# EAGLE design ir-reciever-test (EAGLE 6.3)
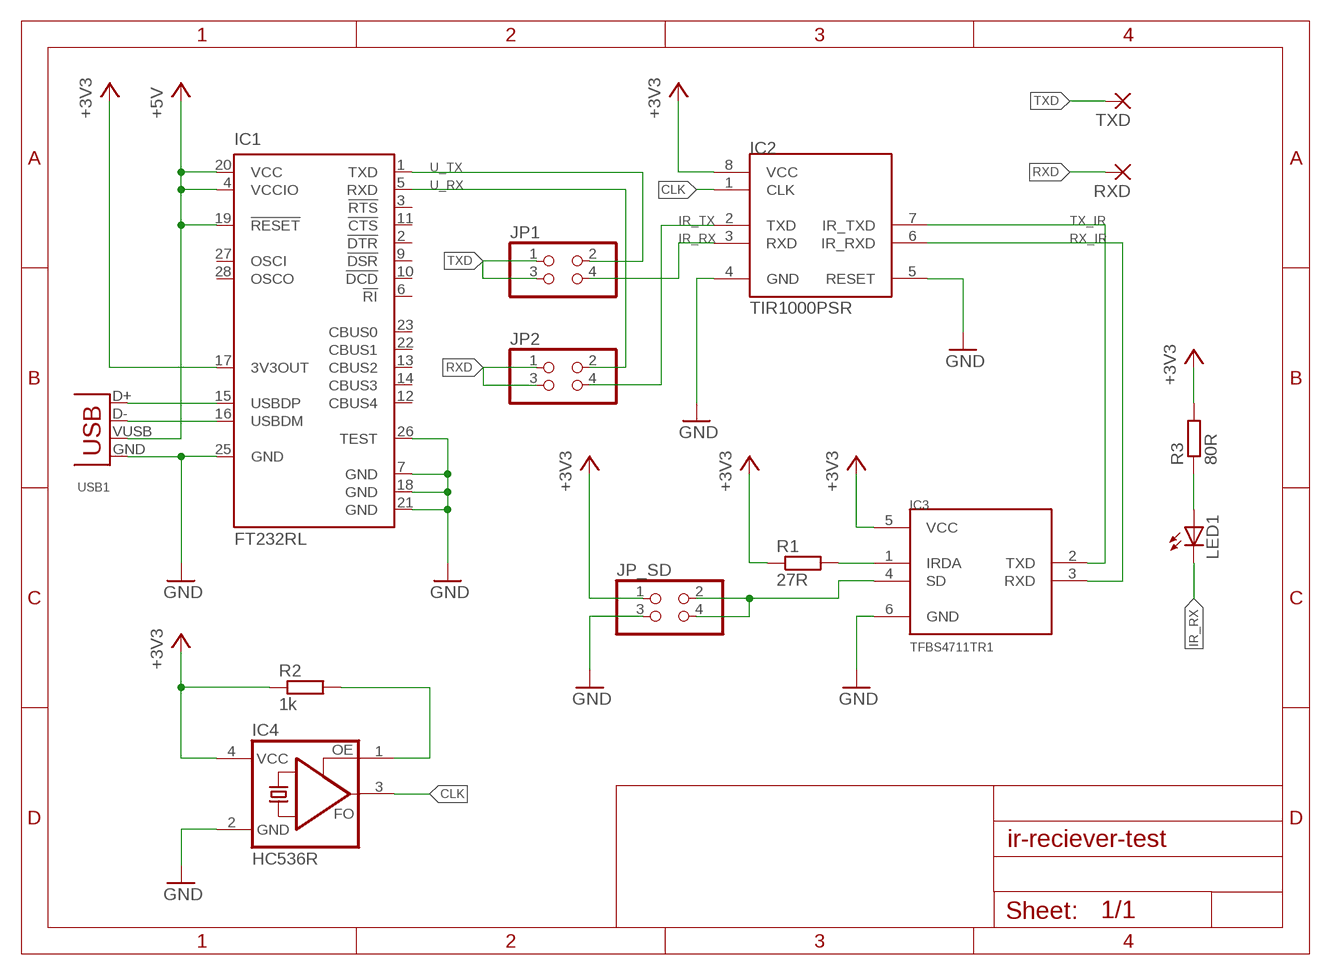
[diagram p0: schematic, sheet 1]

## Parts
IC1  FT232RL  [SSOP28]
IC2  TIR1000PSR  [SO-08]
IC3  TFBS4711TR1  [TFBS4711]
IC4  HC536R  [HC536]
JP1  PINHD-2X02_2.54-SMD  [2X02SMD]
JP2  PINHD-2X02_2.54-SMD  [2X02SMD]
JP_SD  PINHD-2X02_2.54-SMD  [2X02SMD]
LED1  LED3MM  [LED3MM]
R1  27R  R-EU_R1206  [R1206]
R2  1k  R-EU_R1206  [R1206]
R3  80R  R-EU_R1206  [R1206]
RXD  SMD5  [SMD2,54-5,08]
TXD  SMD5  [SMD2,54-5,08]
USB1  USB-B-S  [USB-B-SMT]

## Nets
+3V3: IC1.17(3V3OUT) IC2.8(VCC) IC3.5(VCC) IC4.4(VCC) JP_SD.1 R1.1 R2.1 R3.2
+5V: IC1.4(VCCIO) IC1.19(!RESET) IC1.20(VCC) USB1.VUSB(VBUS)
CLK: IC2.1(CLK) IC4.3(FO)
D+: IC1.15(USBDP) USB1.D+
D-: IC1.16(USBDM) USB1.D-
GND: IC1.7(GND) IC1.18(GND) IC1.21(GND) IC1.25(GND) IC1.26(TEST) IC2.4(GND) IC2.5(RESET) IC3.6(GND) IC4.2(GND) JP_SD.3 USB1.GND
IR_RX: IC2.3(RXD) JP1.4 LED1.K(C)
IR_TX: IC2.2(TXD) JP2.4
N$1: LED1.A R3.1
N$3: IC3.1(IRDA) R1.2
N$5: IC3.4(SD) JP_SD.2 JP_SD.4
N$6: IC4.1(OE) R2.2
RX_IR: IC2.6(IR_RXD) IC3.3(RXD)
RXD: JP2.1 JP2.3 RXD.1(P)
TX_IR: IC2.7(IR_TXD) IC3.2(TXD)
TXD: JP1.1 JP1.3 TXD.1(P)
U_RX: IC1.5(RXD) JP2.2
U_TX: IC1.1(TXD) JP1.2
Unconnected: IC1.2(!DTR) IC1.3(!RTS) IC1.6(!RI) IC1.9(!DSR) IC1.10(!DCD) IC1.11(!CTS) IC1.12(CBUS4) IC1.13(CBUS2) IC1.14(CBUS3) IC1.22(CBUS1) IC1.23(CBUS0) IC1.27(OSCI) IC1.28(OSCO)

## Library data of the parts
IC1 = ftdichip:FT232R: Source: http://www.ftdichip.com/Documents/DataSheets/DS_FT232R_v104.pdf
IC2 = texas:TIR1000: Texas Instruments TIR1000 STANDALONE IrDATM ENCODER AND DECODER
IC3 = vishay:TFBS4711: TRANSCEIVER IRDA Vishay TFBS4711-TR1 Infrared Transciever 900nm, 600µA, 1m range
IC4 = crystal:HC536: Crystal HC536R For example: Fox Electronics FOX-HC536R
JP1 JP2 JP_SD = pinhead-2:PINHD-2X02: PIN HEADER
LED1 = led:LED: LED OSRAM: - CHIPLED LG R971, LG N971, LY N971, LG Q971, LY Q971, LO R971, LY R971 LH N974, LH R974 LS Q976, LO Q976, LY Q976 LO Q996 - Hyper CHIPLED LW Q18S LB Q993, LB Q99A, LB R99A - SideLED LS A670, LO A670, LY A670, LG A670, LP A670 LB A673, LV A673, LT A673, LW A673 LH A674 LY A675 LS A676, LA A676, LO A676, LY A676, LW A676 LS A679, LY A679, LG A679 - Hyper Micro SIDELED® LS Y876, LA Y876, LO Y876, LY Y876 LT Y87S - SmartLED LW L88C, LW L88S LB L89C, LB L89S, LG L890 LS L89K, LO L89K, LY L89K LS L896, LA L896, LO L896, LY L896 - TOPLED LS T670, LO T670, LY T670, LG T670, LP T670 LSG T670, LSP T670, LSY T670, LOP T670, LYG T670 LG T671, LOG T671, LSG T671 LB T673, LV T673, LT T673, LW T673 LH T674 LS T676, LA T676, LO T676, LY T676, LB T676, LH T676, LSB T676, LW T676 LB T67C, LV T67C, LT T67C, LS T67K, LO T67K, LY T67K, LW E67C LS E67B, LA E67B, LO E67B, LY E67B, LB E67C, LV E67C, LT E67C LW T67C LS T679, LY T679, LG T679 LS T770, LO T770, LY T770, LG T770, LP T770 LB T773, LV T773, LT T773, LW T773 LH T774 LS E675, LA E675, LY E675, LS T675 LS T776, LA T776, LO T776, LY T776, LB T776 LHGB T686 LT T68C, LB T68C - Hyper Mini TOPLED® LB M676 - Mini TOPLED Santana® LG M470 LS M47K, LO M47K, LY M47K Source: http://www.osram.convergy.de LUXEON: - LUMILED® LXK2-PW12-R00, LXK2-PW12-S00, LXK2-PW14-U00, LXK2-PW14-V00 LXK2-PM12-R00, LXK2-PM12-S00, LXK2-PM14-U00 LXK2-PE12-Q00, LXK2-PE12-R00, LXK2-PE12-S00, LXK2-PE14-T00, LXK2-PE14-U00 LXK2-PB12-K00, LXK2-PB12-L00, LXK2-PB12-M00, LXK2-PB14-N00, LXK2-PB14-P00, LXK2-PB14-Q00 LXK2-PR12-L00, LXK2-PR12-M00, LXK2-PR14-Q00, LXK2-PR14-R00 LXK2-PD12-Q00, LXK2-PD12-R00, LXK2-PD12-S00 LXK2-PH12-R00, LXK2-PH12-S00 LXK2-PL12-P00, LXK2-PL12-Q00, LXK2-PL12-R00 Source: www.luxeon.com KINGBRIGHT: KA-3528ASYC Source: www.kingbright.com
R1-R3 = rcl:R-EU_: RESISTOR, European symbol
RXD TXD = wirepad:SMD5: SMD PAD
USB1 = con-usb-3:USB: USB Connectors

## Board
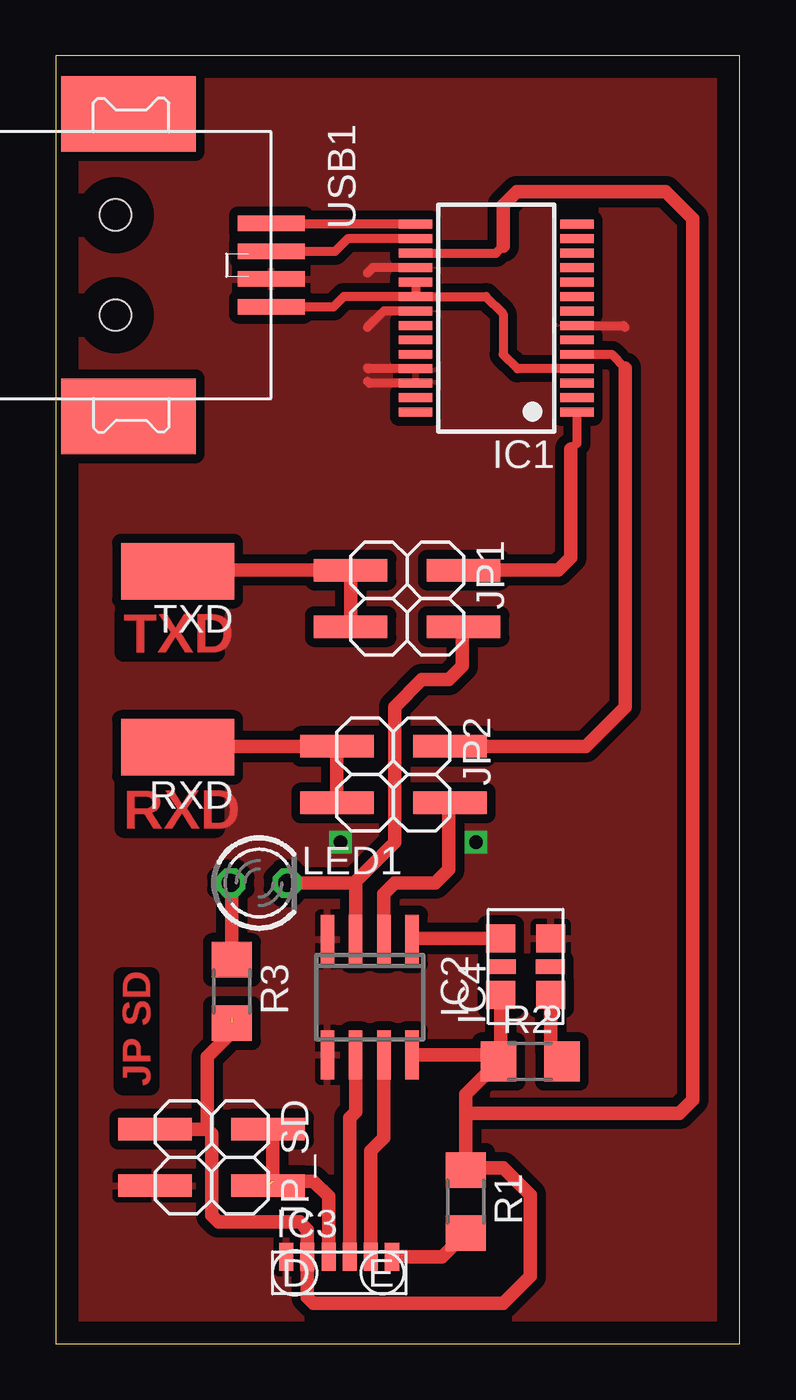
[diagram p1: board, top side]
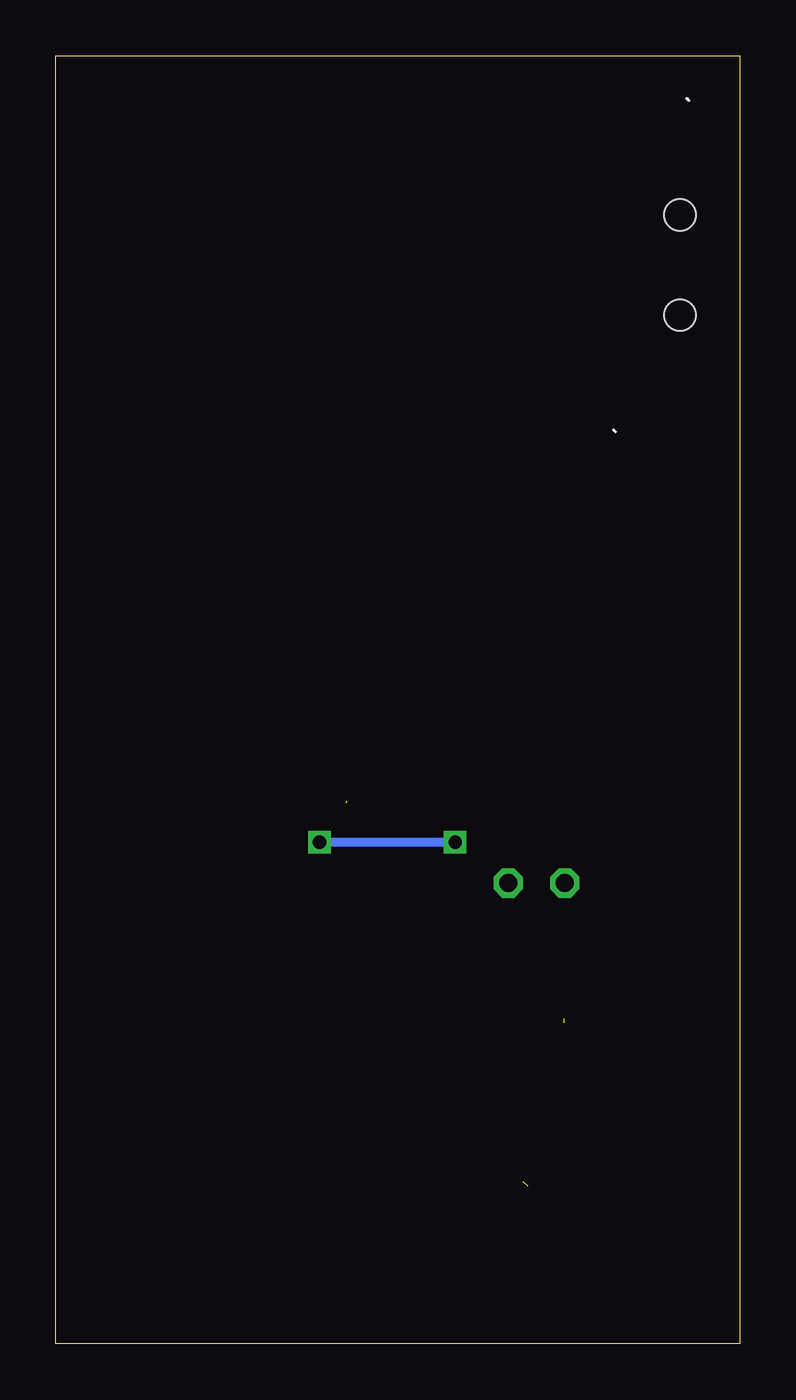
[diagram p2: board, bottom side, seen from below]

Size 30.76 x 57.94 mm. Coordinates in mm from the lower left corner, seen from the top.
Outline: 0,0 30.77,0 30.77,57.94 0,57.94 0,0
Copper layers (1*16): Top 0.035mm / dielectric 1.5mm / Bottom 0.035mm
Design rules: minimum track width 10mil, minimum drill 24mil, track to track 8mil, track to pad 8mil, pad to pad 8mil, via to via 8mil, smd to smd 8mil, copper to edge 40mil, drill to drill 8mil, minimum pad ring 10mil, minimum via ring 8mil, stop-mask expansion 4mil, vias tented up to drill 0mil, thermal gap 10mil

### Footprints (pad centres in the part's own frame; a part is rotated, then mirrored left to right if it is on the bottom)
SSOP28 = smd 0.4 x 1.5: 1 -4.225,-3.625; 2 -3.575,-3.625; 3 -2.925,-3.625; 4 -2.275,-3.625; 5 -1.625,-3.625; 6 -0.975,-3.625; 7 -0.325,-3.625; 8 0.325,-3.625; 9 0.975,-3.625; 10 1.625,-3.625; 11 2.275,-3.625; 12 2.925,-3.625; 13 3.575,-3.625; 14 4.225,-3.625; 15 4.225,3.625; 16 3.575,3.625; 17 2.925,3.625; 18 2.275,3.625; 19 1.625,3.625; 20 0.975,3.625; 21 0.325,3.625; 22 -0.325,3.625; 23 -0.975,3.625; 24 -1.625,3.625; 25 -2.275,3.625; 26 -2.925,3.625; 27 -3.575,3.625; 28 -4.225,3.625
SO-08 = smd 0.6 x 2.2: 1 -1.905,-2.6; 2 -0.635,-2.6; 3 0.635,-2.6; 4 1.905,-2.6; 5 1.905,2.6; 6 0.635,2.6; 7 -0.635,2.6; 8 -1.905,2.6
TFBS4711 = smd 0.635 x 1.27: 1 2.37,0.72; 2 1.42,0.72; 3 0.47,0.72; 4 -0.48,0.72; 5 -1.43,0.72; 6 -2.38,0.72
HC536 = smd 1.24 x 1.29: 1 -1.27,-1.125; 2 1.27,-1.125; 3 1.27,1.125; 4 -1.27,1.125 | smd 0.64 x 1.29: TP1 0,1.1; TP2 0,-1.1
2X02SMD = smd 1.016 x 3.302: 1 -1.27,-3.81; 2 -1.27,1.27; 3 1.27,-3.81; 4 1.27,1.27
LED3MM = drill 0.813 octagon: A -1.27,0; K 1.27,0
R1206 = smd 1.6 x 1.803: 1 -1.422,0; 2 1.422,0
SMD2,54-5,08 = smd 2.54 x 5.08: 1 0,0
USB-B-SMT = smd 6.04 x 3.4: 5 0.58,6.8; 6 0.58,-6.8 | smd 3 x 0.7: D+ 7,1.875; D- 7,0.625; GND 7,-0.625; VUSB 7,-1.875 | hole 1.4: 0,2.25; 0,-2.25

### Placement (x,y rotation side)
IC1  19.81,46.13 90 top
IC2  14.12,15.6 180 top
IC3  12.75,3.2 0 top
IC4  21.13,16.97 90 top
JP1  17.07,33.53 270 top
JP2  16.46,25.6 270 top
JP_SD  8.28,8.38 270 top
LED1  9.14,20.73 0 top
R1  18.44,6.4 270 top
R2  21.34,12.7 0 top
R3  7.92,15.85 270 top
RXD  5.49,26.82 90 top
TXD  5.49,34.75 90 top
USB1  2.69,48.51 0 top

### Tracks (layer width: path | path; a pad name or v marks a point on that pad's centre or on a via)
+3V3  (1 unrouted)
  Top 0.406: IC1.17 19.79,49.05 20.12,49.38
  Top 0.61: IC4.4 20.01,12.91 20.12,12.8 20.02,12.8 R2.1 | 18.44,10.36 R1.1 18.54,7.92 20.12,7.92 21.34,6.71 21.34,3.05 20.12,1.83 11.58,1.83 11.32,2.09 IC3.5 11.32,5.14 10.97,5.49 7.32,5.49 7.01,5.79 7.01,9.45 6.81,9.65 | 18.44,10.36 18.44,11.23 R2.1 | IC2.8 19.62,13 R2.1 | JP_SD.1 6.81,9.65 | 20.12,49.38 20.12,51.21 20.73,51.82 27.43,51.82 28.65,50.6 28.65,10.97 28.04,10.36 18.44,10.36 | 6.81,9.65 6.81,12.9 7.92,14.02 7.92,14.63
+5V
  Top 0.406: IC1.20 12.96,47.1 12.5,46.64 USB1.VUSB | IC1.19 IC1.20 | IC1.20 19.34,47.1 20.12,46.33 20.12,44.5 20.77,43.85 IC1.4
CLK
  Top 0.61: IC4.3 16.07,18.24 IC2.1
D+
  Top 0.406: IC1.15 9.73,50.35 USB1.D+
D-
  Top 0.406: IC1.16 13.12,49.7 12.56,49.14 USB1.D-
GND  (via drill 0.6)
  Top 0.406: IC1.26 14.1,43.2 14.02,43.28 | IC1.25 14.06,43.85 14.02,43.89 | IC1.21 14.75,46.45 14.02,45.72 | IC1.18 14.26,48.4 14.02,48.16 | IC1.7 25.52,45.8 25.6,45.72
  Bottom 0.406: v12.8,22.55 v18.9,22.55
  pour Top (isolate 0.406): 0,0 0,57.91 31.09,57.91 31.09,0
IR_RX
  Top 0.61: IC2.3 13.49,20.8 | 13.49,20.8 15.24,22.55 15.24,28.65 16.46,29.87 17.68,29.87 18.29,30.48 18.29,32.21 JP1.4 | LED1.K 13.41,20.73 13.49,20.8
IR_TX  (1 unrouted)
  Top 0.61: IC2.2 14.76,20.24 15.24,20.73 17.07,20.73 17.68,21.34 17.68,24.38
N$1
  Top 0.61: R3.1 7.92,20.68 LED1.A
N$3
  Top 0.61: IC3.1 17.38,3.92 R1.2
N$5  (1 unrouted)
  Top 0.61: IC3.4 12.27,6.63 11.58,7.32 9.75,7.32 9.75,9.45 JP_SD.2
N$6
  Top 0.61: IC4.1 22.26,13.2 R2.2
RX_IR
  Top 0.61: IC3.3 13.22,10.17 13.49,10.44 IC2.6
RXD
  Top 0.61: RXD.1 5.54,26.87 JP2.1 JP2.3
TX_IR
  Top 0.61: IC3.2 14.17,8.68 14.76,9.27 IC2.7
TXD
  Top 0.61: JP1.3 JP1.1 5.54,34.8 TXD.1
U_RX
  Top 0.406: IC1.5 24.99,44.5 25.6,43.89
  Top 0.61: 25.6,43.89 25.6,28.65 23.82,26.87 JP2.2
U_TX
  Top 0.406: IC1.1 23.44,40.51 23.16,40.23
  Top 0.61: JP1.2 22.61,34.8 23.16,35.36 23.16,40.23

### Text on the board
Top: TXD | RXD | JP SD